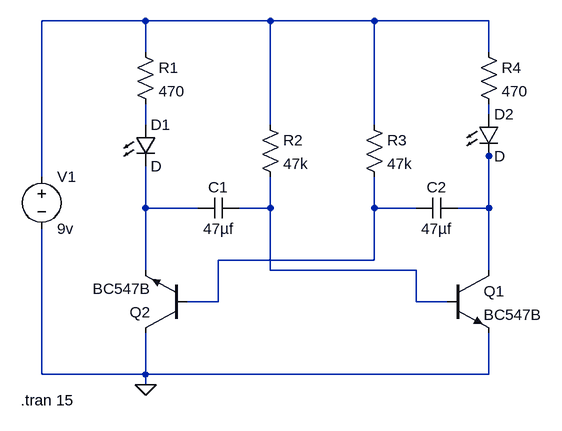
[diagram p0: schematic astable multivibrator.asc]
astable multivibrator.asc, the LTspice schematic file:
Version 4.1
SHEET 1 880 680
WIRE -32 -80 -192 -80
WIRE 160 -80 -32 -80
WIRE 320 -80 160 -80
WIRE 496 -80 320 -80
WIRE -32 -32 -32 -80
WIRE 496 -32 496 -80
WIRE 496 64 496 48
WIRE -32 80 -32 48
WIRE 160 80 160 -80
WIRE 320 80 320 -80
WIRE 496 128 496 112
WIRE -192 160 -192 -80
WIRE -32 208 -32 144
WIRE 48 208 -32 208
WIRE 160 208 160 160
WIRE 160 208 112 208
WIRE 320 208 320 160
WIRE 384 208 320 208
WIRE 496 208 496 128
WIRE 496 208 448 208
WIRE 320 288 320 208
WIRE 320 288 80 288
WIRE -32 304 -32 208
WIRE 160 304 160 208
WIRE 384 304 160 304
WIRE 496 304 496 208
WIRE 80 352 80 288
WIRE 80 352 32 352
WIRE 384 352 384 304
WIRE 432 352 384 352
WIRE -192 464 -192 240
WIRE -32 464 -32 400
WIRE -32 464 -192 464
WIRE 496 464 496 400
WIRE 496 464 -32 464
WIRE -32 480 -32 464
FLAG -32 480 0
SYMBOL res -48 -48 R0
SYMATTR InstName R1
SYMATTR Value 470
SYMBOL res 144 64 R0
SYMATTR InstName R2
SYMATTR Value 47k
SYMBOL res 304 64 R0
SYMATTR InstName R3
SYMATTR Value 47k
SYMBOL res 480 -48 R0
SYMATTR InstName R4
SYMATTR Value 470
SYMBOL cap 112 192 R90
WINDOW 0 0 32 VBottom 2
WINDOW 3 32 32 VTop 2
SYMATTR InstName C1
SYMATTR Value 47µf
SYMBOL cap 448 192 R90
WINDOW 0 0 32 VBottom 2
WINDOW 3 32 32 VTop 2
SYMATTR InstName C2
SYMATTR Value 47µf
SYMBOL LED -48 80 R0
SYMATTR InstName D1
SYMBOL LED 480 64 R0
SYMATTR InstName D2
SYMBOL npn 432 304 R0
SYMATTR InstName Q1
SYMATTR Value BC547B
SYMBOL npn 32 400 R180
SYMATTR InstName Q2
SYMATTR Value BC547B
SYMBOL voltage -192 144 R0
WINDOW 123 0 0 Left 0
WINDOW 39 0 0 Left 0
SYMATTR InstName V1
SYMATTR Value 9v
TEXT -224 504 Left 2 !.tran 15

The netlist it stands for:
* astable multivibrator.asc
R1 N001 N003 470
R2 N001 N006 47k
R3 N001 N007 47k
R4 N001 N002 470
C1 N006 N005 47µf
C2 N004 N007 47µf
D1 N003 N005 D
D2 N002 N004 D
Q1 N004 N006 0 0 BC547B
Q2 0 N007 N005 0 BC547B
V1 N001 0 9v
.model D D
.lib standard.dio
.model NPN NPN
.model PNP PNP
.lib standard.bjt
.tran 15
.backanno
.end